# Altium project 电赛小车.PrjPcb
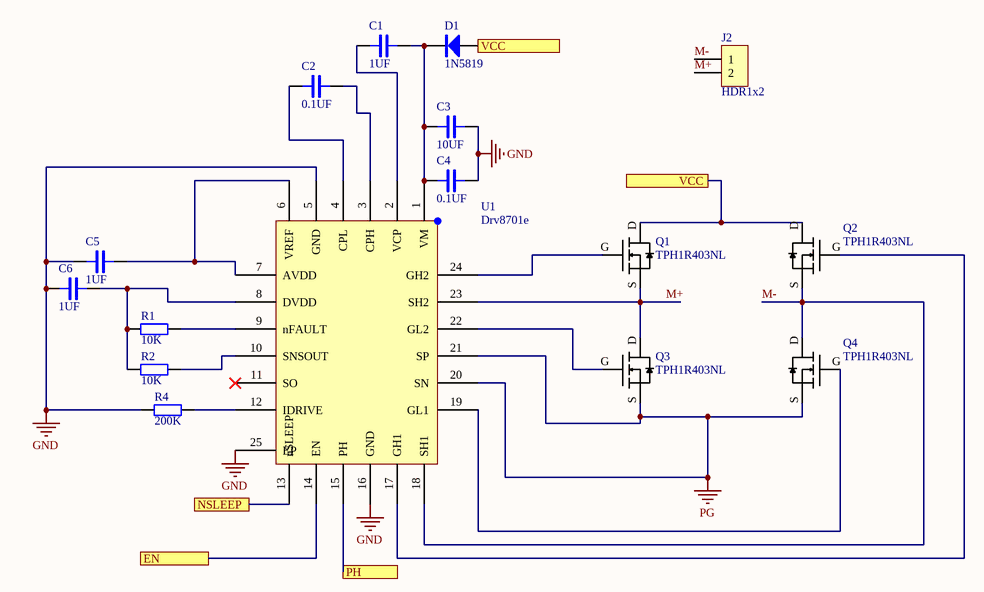
[diagram p0: Sheet1.SchDoc]
1 sheet, 16 parts. Net scope: flat (ports and power ports of the same name join across sheets).
Board file: PCB1.PcbDoc

## Sheet Sheet1.SchDoc
size A4 portrait

### Parts
C1  1UF  [0603]
C2  0.1UF  [0603]
C3  10UF  [0603]
C4  0.1UF  [0603]
C5  1UF  [0603]
C6  1UF  [0603]
D1  1N5819  [SOD-123]
J2  HDR1x2  [TX30_接口]
Q1  TPH1R403NL  [TPH1R403NL]
Q2  TPH1R403NL  [TPH1R403NL]
Q3  TPH1R403NL  [TPH1R403NL]
Q4  TPH1R403NL  [TPH1R403NL]
R1  10K  [0603]
R2  10K  [0603]
R4  200K  [0603]
U1  Drv8701e  [DRV8701E]

### Ports
EN, NSLEEP, PH, VCC

### Nets
GND: C3.2 C4.2 C5.1 C6.1 R4.2 U1.5(GND) U1.16(GND) U1.25(EP)
PG: Q3.S Q4.S U1.20(SN) U1.21(SP)
M+: J2.2 Q1.S Q3.D U1.23(SH2)
M-: J2.1 Q2.S Q4.D U1.18(SH1)
NetC1_1: C1.1 U1.2(VCP)
NetC1_2: C1.2 C3.1 C4.1 D1.2(K) U1.1(VM)
NetC2_1: C2.1 U1.4(CPL)
NetC2_2: C2.2 U1.3(CPH)
NetC5_2: C5.2 U1.6(VREF) U1.7(AVDD)
NetC6_2: C6.2 R1.2 R2.2 U1.8(DVDD)
NetD1_1: D1.1(A) Q1.D Q2.D ; port VCC
NetQ1_G: Q1.G(S) U1.24(GH2)
NetQ2_G: Q2.G(S) U1.17(GH1)
NetQ3_G: Q3.G(S) U1.22(GL2)
NetQ4_G: Q4.G(S) U1.19(GL1)
NetR1_1: R1.1 U1.9(nFAULT)
NetR2_1: R2.1 U1.10(SNSOUT)
NetR4_1: R4.1 U1.12(IDRIVE)
NetU1_13: U1.13(nSLEEP) ; port NSLEEP
NetU1_14: U1.14(EN) ; port EN
NetU1_15: U1.15(PH) ; port PH

Not connected (* = marked no-connect by the designer): U1 11(SO)*

### Notes on the sheet
- Title
- Size:
- Date:
- A4
- Number:
- Time:
- Revision:
- Sheet
- of
- File:

### Library data of the parts
C1-C6 = CAP: Capacitor
D1 = 1N4148: 高速开关二极管; 版权归属: 源创客; BOM名称: 高速开关二极管; 学习资源: www.ooocke.com
J2 = HDR1x2: Connector
R1 R2 R4 = RES: Resistor